# EAGLE design rpi2_brkout (EAGLE 7.7.0)
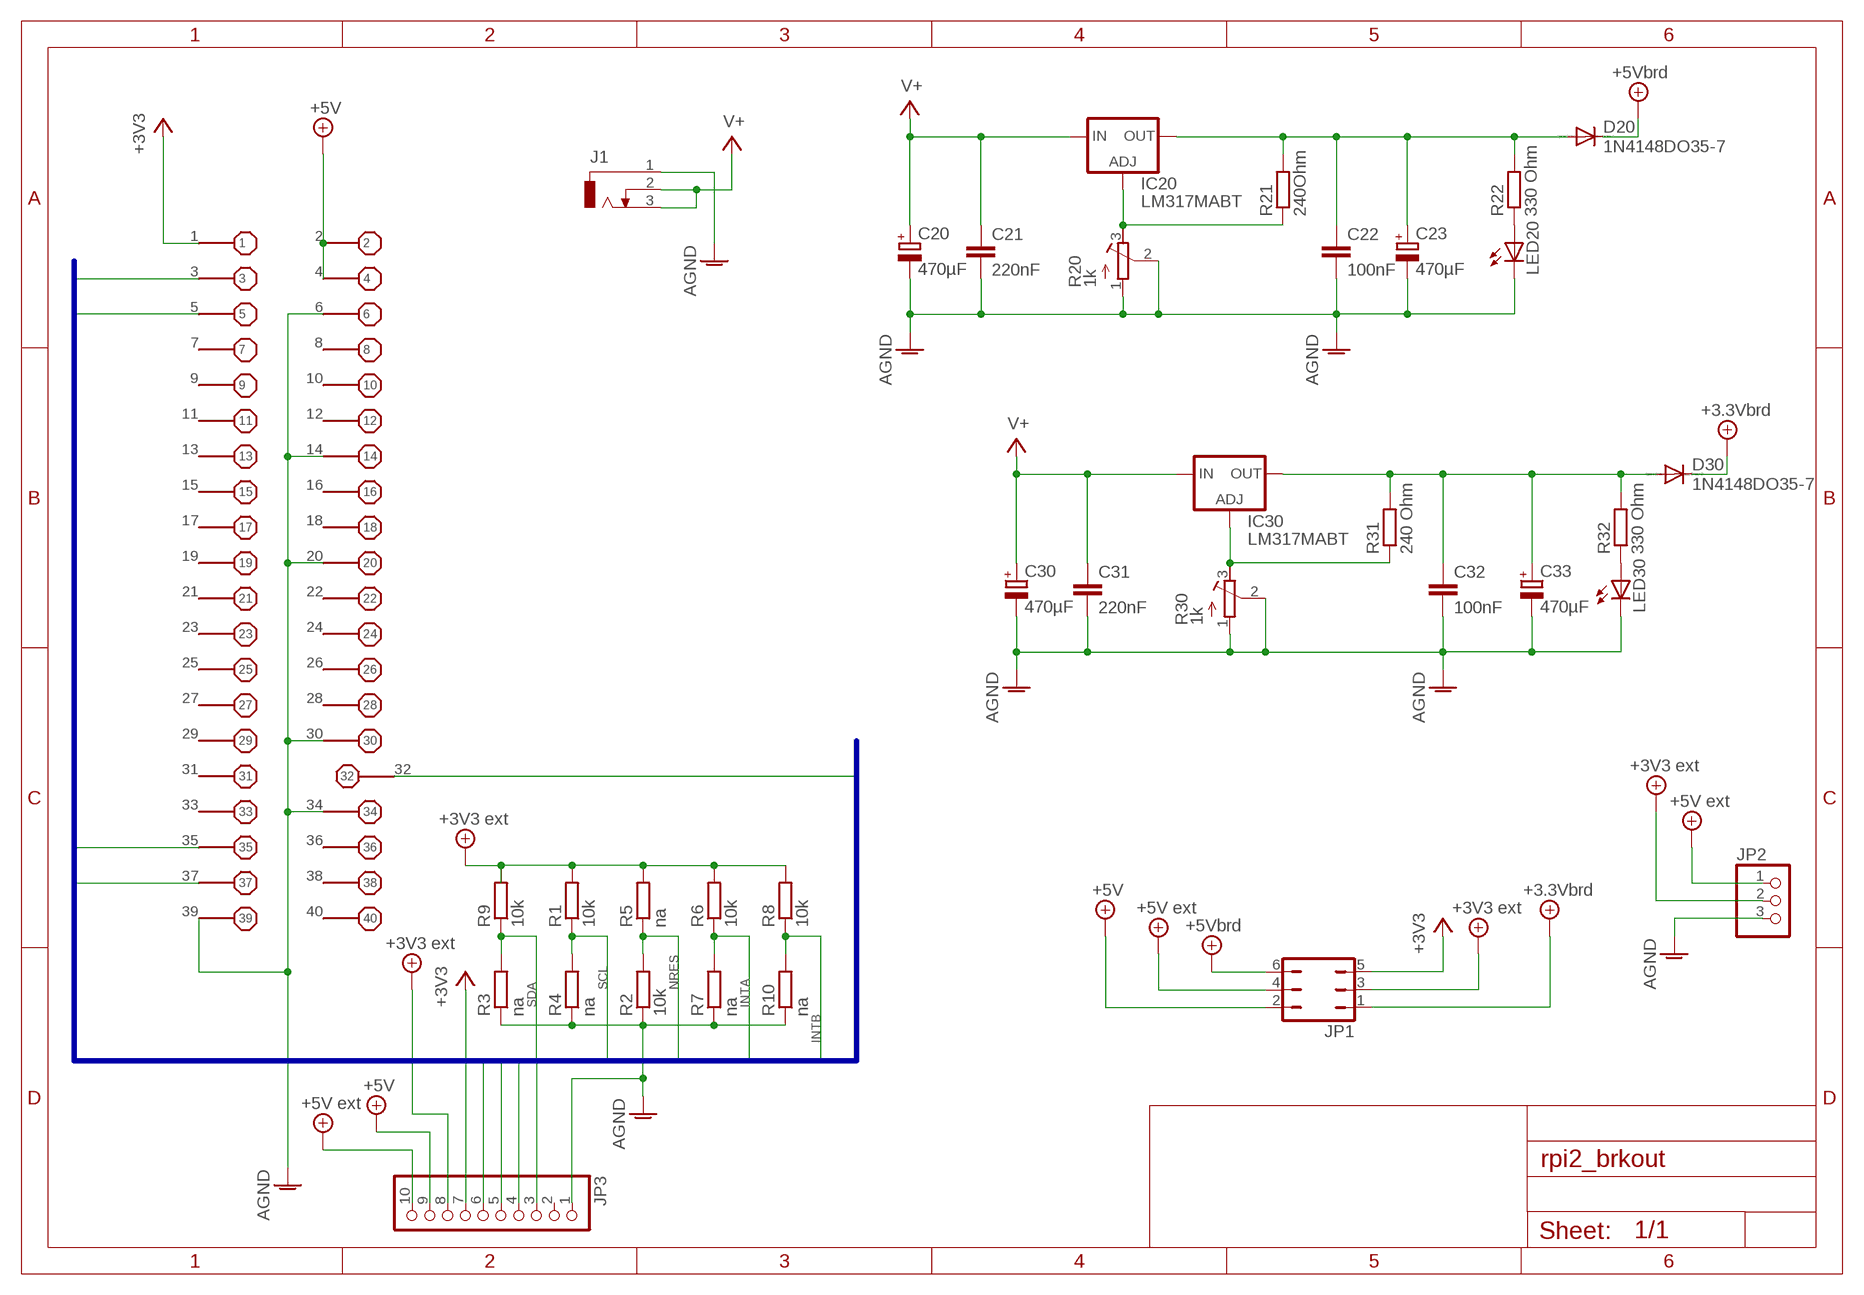
[diagram p0: schematic, sheet 1]

## Parts
C20  470µF  CPOL-EUE5-10.5  [E5-10,5]
C21  220nF  C-EU050-030X075  [C050-030X075]
C22  100nF  C-EU025-025X050  [C025-025X050]
C23  470µF  CPOL-EUE5-10.5  [E5-10,5]
C30  470µF  CPOL-EUE5-10.5  [E5-10,5]
C31  220nF  C-EU050-030X075  [C050-030X075]
C32  100nF  C-EU025-025X050  [C025-025X050]
C33  470µF  CPOL-EUE5-10.5  [E5-10,5]
D20  1N4148DO35-7  [DO35-7]
D30  1N4148DO35-7  [DO35-7]
IC20  LM317MABT  [TO220L1]
IC30  LM317MABT  [TO220L1]
J1  DCJ0303  [DCJ0303]
JP1  JP3Q  [JP3Q]
JP2  PINHD-1X3  [1X03]
JP3  PINHD-1X10  [1X10]
LED20  LED5MM  [LED5MM]
LED30  LED5MM  [LED5MM]
R1  10k  R-EU_R0805  [R0805]
R2  10k  R-EU_R0805  [R0805]
R3  na  R-EU_R0805  [R0805]
R4  na  R-EU_R0805  [R0805]
R5  na  R-EU_R0805  [R0805]
R6  10k  R-EU_R0805  [R0805]
R7  na  R-EU_R0805  [R0805]
R8  10k  R-EU_R0805  [R0805]
R9  10k  R-EU_R0805  [R0805]
R10  na  R-EU_R0805  [R0805]
R20  1k  R-TRIMM64W  [RTRIM64W]
R21  240Ohm  R-EU_0207/10  [0207/10]
R22  330 Ohm  R-EU_0207/10  [0207/10]
R30  1k  R-TRIMM64W  [RTRIM64W]
R31  240 Ohm  R-EU_0207/10  [0207/10]
R32  330 Ohm  R-EU_0207/10  [0207/10]
X1  B+_GPIO  [B+_GPIO]

## Nets
3.3VEXT: R1.2 R5.2 R6.2 R8.2 R9.2 ; supply symbol labelled +3V3 ext
+3V3: JP1.5 JP3.7 X1.1
+5V: JP1.2 JP3.9 X1.2 X1.4
+5V/1: JP1.4 JP2.1 JP3.10 ; supply symbol labelled +5V ext
+5V/2: JP1.3 JP2.2 JP3.8 ; supply symbol labelled +3V3 ext
+5V/3: D30.C JP1.1 ; supply symbol labelled +3.3Vbrd
+5V/4: D20.C JP1.6 ; supply symbol labelled +5Vbrd
AGND: C20.- C21.2 C22.2 C23.- C30.- C31.2 C32.2 C33.- J1.1 JP2.3 JP3.1 LED20.K(C) LED30.K(C) R2.1 R3.1 R4.1 R7.1 R10.1 R20.1(A) R20.2(S) R30.1(A) R30.2(S) X1.6 X1.14 X1.20 X1.30 X1.34 X1.39
INTA: JP3.5 R6.1 R7.2 X1.37
INTB: JP3.6 R8.1 R10.2 X1.35
N$1: IC30.1(ADJ) R30.3(E) R31.1
N$2: IC20.1(ADJ) R20.3(E) R21.1
N$3: C22.1 C23.+ D20.A IC20.2(OUT) R21.2 R22.2
N$4: LED20.A R22.1
N$5: C32.1 C33.+ D30.A IC30.2(OUT) R31.2 R32.2
N$6: LED30.A R32.1
NRES: R2.2 R5.1 X1.32
SCL: JP3.4 R1.1 R4.2 X1.5
SDA: JP3.3 R3.2 R9.1 X1.3
V+: C20.+ C21.1 C30.+ C31.1 IC20.3(IN) IC30.3(IN) J1.2 J1.3
Unconnected: JP3.2 X1.7 X1.8 X1.9 X1.10 X1.11 X1.12 X1.13 X1.15 X1.16 X1.17 X1.18 X1.19 X1.21 X1.22 X1.23 X1.24 X1.25 X1.26 X1.27 X1.28 X1.29 X1.31 X1.33 X1.36 X1.38 X1.40

## Buses
INTA,INTB,SCL,SDA,NRES

## Library data of the parts
C20 C23 C30 C33 = rcl:CPOL-EU: POLARIZED CAPACITOR, European symbol
C21 C22 C31 C32 = rcl:C-EU: CAPACITOR, European symbol
D20 D30 = diode:1N4148: DIODE high speed (Philips)
IC20 IC30 = v-reg:LM317?*: 500 mA Adjustable Output Positive Voltage Regulator Source: http://www.onsemi.co.jp .. LM317M-D.PDF
J1 = con-jack:DCJ0303: DC POWER JACK Source: DCJ0303.pdf; OC_FARNELL: unknown; OC_NEWARK: unknown
JP1 = jumper:JP3Q: JUMPER
JP2 = pinhead:PINHD-1X3: PIN HEADER
JP3 = pinhead:PINHD-1X10: PIN HEADER
LED20 LED30 = led:LED: LED OSRAM: - CHIPLED LG R971, LG N971, LY N971, LG Q971, LY Q971, LO R971, LY R971 LH N974, LH R974 LS Q976, LO Q976, LY Q976 LO Q996 - Hyper CHIPLED LW Q18S LB Q993, LB Q99A, LB R99A - SideLED LS A670, LO A670, LY A670, LG A670, LP A670 LB A673, LV A673, LT A673, LW A673 LH A674 LY A675 LS A676, LA A676, LO A676, LY A676, LW A676 LS A679, LY A679, LG A679 - Hyper Micro SIDELED® LS Y876, LA Y876, LO Y876, LY Y876 LT Y87S - SmartLED LW L88C, LW L88S LB L89C, LB L89S, LG L890 LS L89K, LO L89K, LY L89K LS L896, LA L896, LO L896, LY L896 - TOPLED LS T670, LO T670, LY T670, LG T670, LP T670 LSG T670, LSP T670, LSY T670, LOP T670, LYG T670 LG T671, LOG T671, LSG T671 LB T673, LV T673, LT T673, LW T673 LH T674 LS T676, LA T676, LO T676, LY T676, LB T676, LH T676, LSB T676, LW T676 LB T67C, LV T67C, LT T67C, LS T67K, LO T67K, LY T67K, LW E67C LS E67B, LA E67B, LO E67B, LY E67B, LB E67C, LV E67C, LT E67C LW T67C LS T679, LY T679, LG T679 LS T770, LO T770, LY T770, LG T770, LP T770 LB T773, LV T773, LT T773, LW T773 LH T774 LS E675, LA E675, LY E675, LS T675 LS T776, LA T776, LO T776, LY T776, LB T776 LHGB T686 LT T68C, LB T68C - Hyper Mini TOPLED® LB M676 - Mini TOPLED Santana® LG M470 LS M47K, LO M47K, LY M47K Source: http://www.osram.convergy.de LUXEON: - LUMILED® LXK2-PW12-R00, LXK2-PW12-S00, LXK2-PW14-U00, LXK2-PW14-V00 LXK2-PM12-R00, LXK2-PM12-S00, LXK2-PM14-U00 LXK2-PE12-Q00, LXK2-PE12-R00, LXK2-PE12-S00, LXK2-PE14-T00, LXK2-PE14-U00 LXK2-PB12-K00, LXK2-PB12-L00, LXK2-PB12-M00, LXK2-PB14-N00, LXK2-PB14-P00, LXK2-PB14-Q00 LXK2-PR12-L00, LXK2-PR12-M00, LXK2-PR14-Q00, LXK2-PR14-R00 LXK2-PD12-Q00, LXK2-PD12-R00, LXK2-PD12-S00 LXK2-PH12-R00, LXK2-PH12-S00 LXK2-PL12-P00, LXK2-PL12-Q00, LXK2-PL12-R00 Source: www.luxeon.com KINGBRIGHT: KA-3528ASYC Source: www.kingbright.com
R1-R10 R21 R22 R31 R32 = rcl:R-EU_: RESISTOR, European symbol
R20 R30 = rcl:R-TRIMM: Trimm resistor
X1 = raspberry:B+_GPIO

## Board
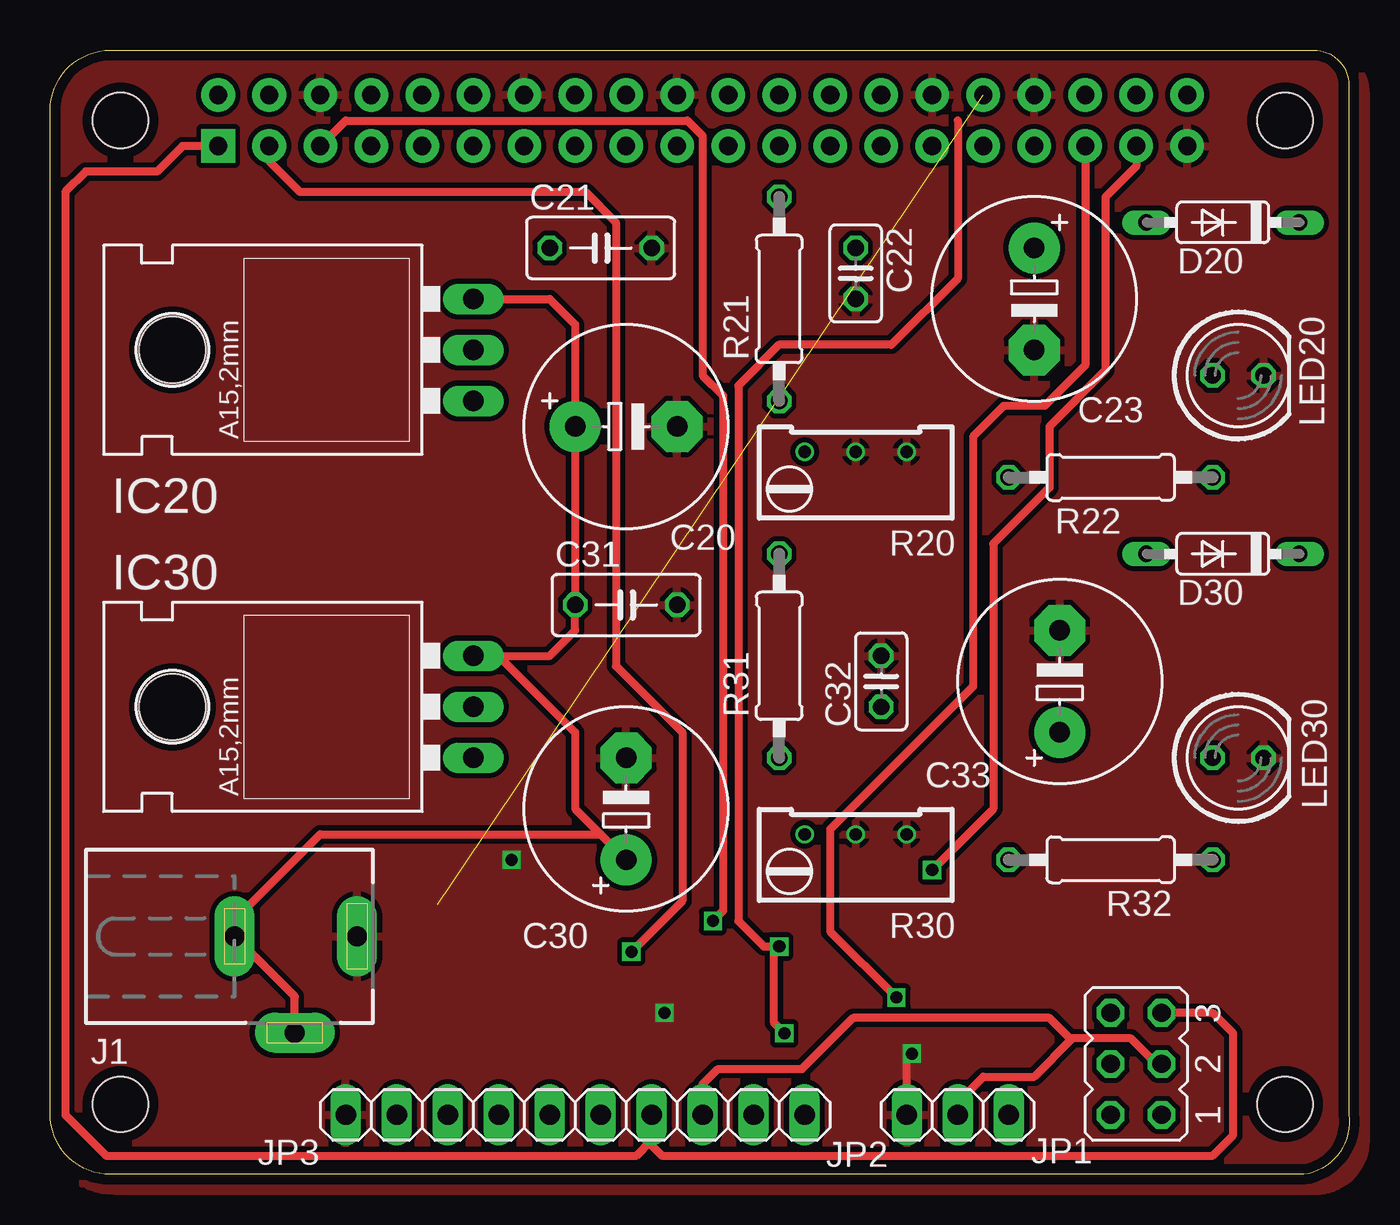
[diagram p1: board, top side]
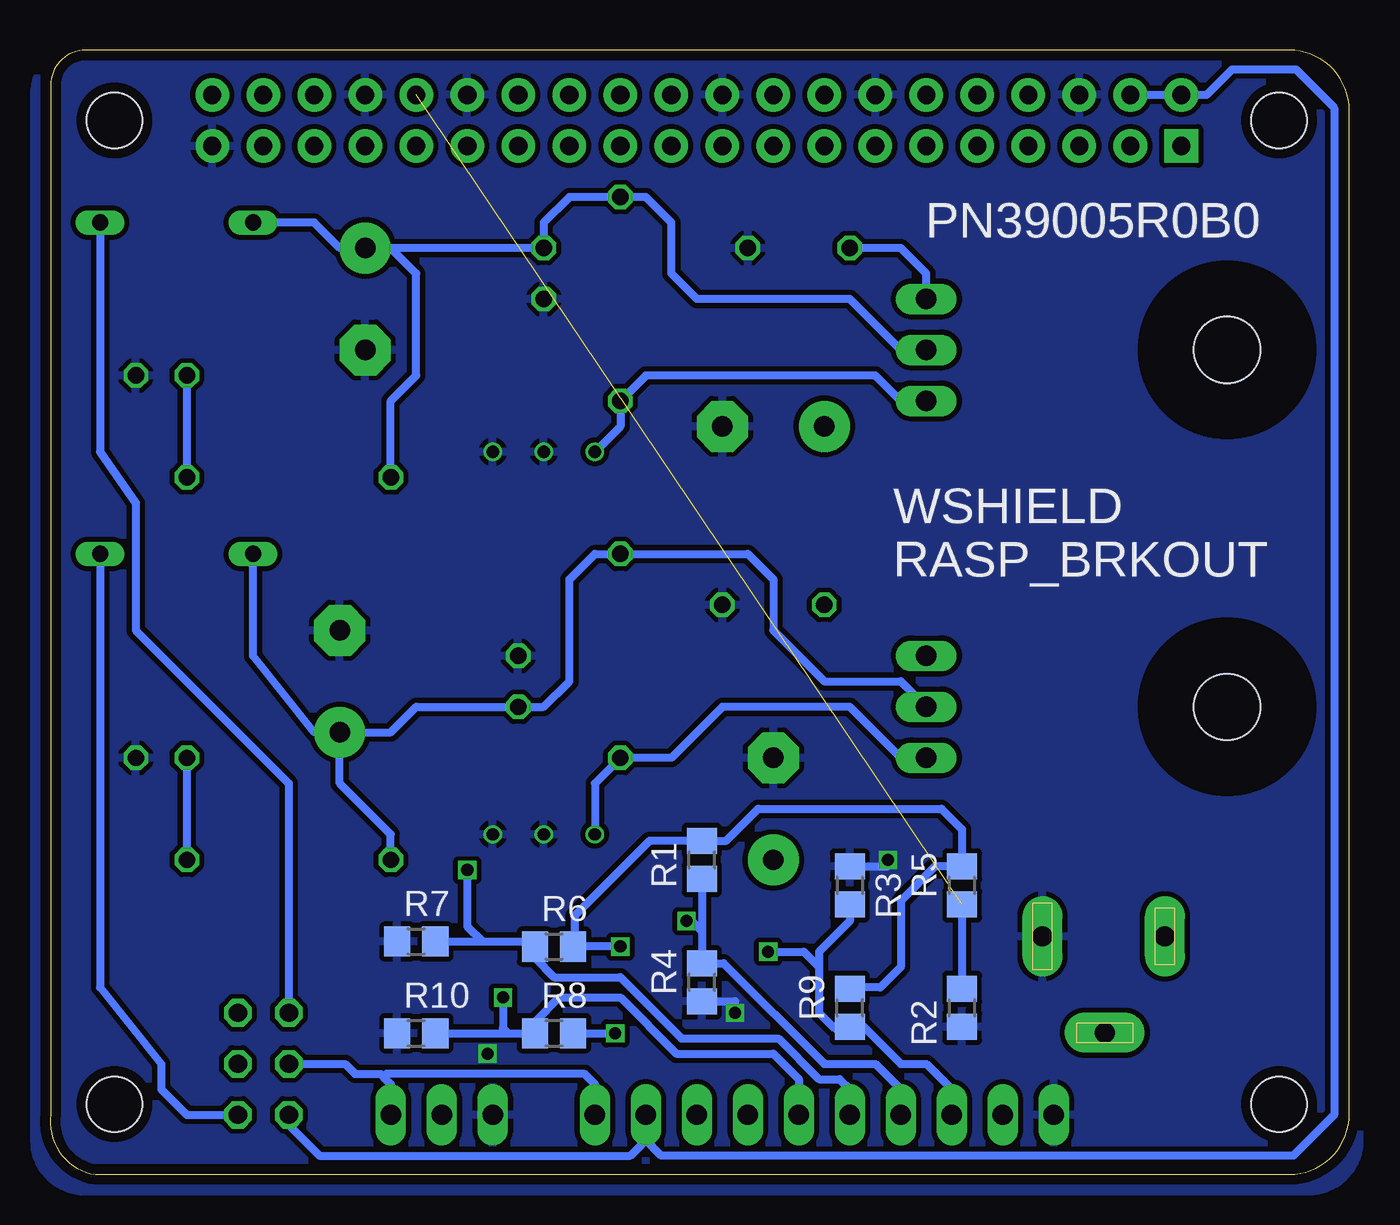
[diagram p2: board, bottom side, seen from below]

Size 64.71 x 56 mm. Coordinates in mm from the lower left corner, seen from the top.
Outline: 0,53 arc-90 3,56 62.95,56 arc-90 64.68,54.27 64.68,3 arc-90 62.44,0 3,0 arc-90 0,3 0,53
Copper layers (1*16): Top 0.035mm / dielectric 1.6mm / Bottom 0.035mm
Design rules "Elecrow_2-layer_PCB_eagle_rule": minimum track width 6mil, minimum drill 12mil, track to track 6mil, track to pad 6mil, pad to pad 6mil, via to via 8mil, smd to smd 0mil, copper to edge 20mil, drill to drill 10mil, minimum pad ring 6mil, minimum via ring 6mil, stop-mask expansion 0mil, vias tented up to drill 100mil, thermal gap 10mil
Holes 2.75 mm at 3.5,52.5 3.5,3.5 61.5,52.5 61.5,3.5

### Footprints (pad centres in the part's own frame; a part is rotated, then mirrored left to right if it is on the bottom)
E5-10,5 = drill 1.016 pad 2.54: + -2.54,0 | drill 1.016 pad 2.54 octagon: - 2.54,0
C050-030X075 = drill 0.813 octagon: 1 -2.54,0; 2 2.54,0
C025-025X050 = drill 0.813 octagon: 1 -1.27,0; 2 1.27,0
DO35-7 = drill 0.813 long: A 3.81,0; C -3.81,0
TO220L1 = drill 1.016 long: 1 -2.54,-3.81; 2 0,-3.81; 3 2.54,-3.81 | hole 3.302: 0,11.176
DCJ0303 = drill 1 pad 2 long: 1 0,3.1; 2 4.8,0; 3 0,-3
JP3Q = drill 0.914 octagon: 1 -2.54,-1.27; 2 -2.54,1.27; 3 0,-1.27; 4 0,1.27; 5 2.54,-1.27; 6 2.54,1.27
1X03 = drill 1.016 long: 1 -2.54,0; 2 0,0; 3 2.54,0
1X10 = drill 1.016 long: 1 -11.43,0; 2 -8.89,0; 3 -6.35,0; 4 -3.81,0; 5 -1.27,0; 6 1.27,0; 7 3.81,0; 8 6.35,0; 9 8.89,0; 10 11.43,0
LED5MM = drill 0.813 octagon: A -1.27,0; K 1.27,0
R0805 = smd 1.3 x 1.5: 1 -0.95,0; 2 0.95,0
RTRIM64W = drill 0.61: 1 1.27,-2.54; 2 1.27,0; 3 1.27,2.54
0207/10 = drill 0.813 octagon: 1 -5.08,0; 2 5.08,0
B+_GPIO = drill 0.9 pad 1.676 square: 1 -24.13,-1.27 | drill 0.9 pad 1.676: 2 -24.13,1.27; 3 -21.59,-1.27; 4 -21.59,1.27; 5 -19.05,-1.27; 6 -19.05,1.27; 7 -16.51,-1.27; 8 -16.51,1.27; 9 -13.97,-1.27; 10 -13.97,1.27; 11 -11.43,-1.27; 12 -11.43,1.27; 13 -8.89,-1.27; 14 -8.89,1.27; 15 -6.35,-1.27; 16 -6.35,1.27; 17 -3.81,-1.27; 18 -3.81,1.27; 19 -1.27,-1.27; 20 -1.27,1.27; 21 1.27,-1.27; 22 1.27,1.27; 23 3.81,-1.27; 24 3.81,1.27; 25 6.35,-1.27; 26 6.35,1.27; 27 8.89,-1.27; 28 8.89,1.27; 29 11.43,-1.27; 30 11.43,1.27; 31 13.97,-1.27; 32 13.97,1.27; 33 16.51,-1.27; 34 16.51,1.27; 35 19.05,-1.27; 36 19.05,1.27; 37 21.59,-1.27; 38 21.59,1.27; 39 24.13,-1.27; 40 24.13,1.27

### Placement (x,y rotation side)
C20  28.69,37.26 0 top
C21  27.42,46.15 0 top
C22  40.12,44.88 270 top
C23  49.01,43.61 270 top
C30  28.69,18.21 90 top
C31  28.69,28.37 0 top
C32  41.39,24.56 90 top
C33  50.28,24.56 90 top
D20  58.41,47.42 180 top
D30  58.41,30.91 180 top
IC20  17.26,41.07 90 top
IC30  17.26,23.29 90 top
J1  12.18,11.86 270 top
JP1  54.09,5.51 90 top
JP2  45.2,2.97 180 top
JP3  26.15,2.97 0 top
LED20  59.17,39.8 0 top
LED30  59.17,20.75 0 top
R1  32.25,15.67 90 bottom
R2  19.29,8.3 90 bottom
R3  24.88,14.4 270 bottom
R4  32.25,9.57 90 bottom
R5  19.29,14.4 90 bottom
R6  39.61,11.35 0 bottom
R7  46.47,11.61 0 bottom
R8  39.61,7.03 0 bottom
R9  24.88,8.3 90 bottom
R10  46.47,7.03 0 bottom
R20  40.12,34.72 90 top
R21  36.31,43.61 90 top
R22  52.82,34.72 180 top
R30  40.12,15.67 90 top
R31  36.31,25.83 90 top
R32  52.82,15.67 180 top
X1  32.5,52.5 0 top

### Tracks (layer width: path | path; a pad name or v marks a point on that pad's centre or on a via)
3.3VEXT  (via drill 0.6)
  Top 0.406: v36.56,7.03 36.06,7.54 36.06,11.1 v36.31,11.35 35.55,11.35 34.28,12.62 34.28,39.29 36.31,41.32 41.9,41.32 45.2,44.63 45.2,52.5
  Bottom 0.406: R9.2 24.81,9.32 23.36,9.32 22.34,10.34 22.34,13.64 20.63,15.35 R5.2 19.29,17.19 20.31,18.21 29.45,18.21 31.04,16.62 R1.2 34.85,16.62 38.6,12.88 38.6,11.42 R6.2 v36.31,11.35 | R8.2 v36.56,7.03
+3V3
  Top 0.406: X1.1 6.59,51.23 5.32,49.96 1.77,49.96 0.75,48.94 0.75,2.97 2.78,0.94 29.2,0.94 29.96,1.7 JP3.7 29.96,1.45 30.47,0.94 57.9,0.94 58.92,1.95 58.92,7.03 57.9,8.05 JP1.5
+5V
  Bottom 0.406: 35.04,1.7 34.28,0.94 2.78,0.94 0.75,2.97 0.75,53.13 2.66,55.04 5.83,55.04 7.1,53.77 X1.2 X1.4 | 35.04,1.7 JP3.9 | JP1.2 52.82,2.46 51.3,0.94 35.8,0.94 35.04,1.7
+5V/1
  Bottom 0.406: JP1.4 50.03,5.51 49.52,5 48.25,5 48.12,4.88 | 48.12,4.88 47.74,4.49 JP2.1 | JP3.10 37.58,4.49 38.09,5 47.99,5 48.12,4.88
+5V/2
  Top 0.406: JP1.3 55.11,5.51 53.84,6.78 50.91,6.78 | JP3.8 32.5,4.49 33.26,5.26 37.45,5.26 39.99,7.8 49.77,7.8 50.79,6.78 50.91,6.78 | JP2.2 45.2,3.6 46.47,4.88 49.01,4.88 50.91,6.78
+5V/3
  Bottom 0.406: D30.C 62.22,9.32 59.17,5.51 59.17,4.24 57.9,2.97 JP1.1
+5V/4
  Bottom 0.406: D20.C 62.22,35.99 60.44,33.45 60.44,27.1 52.82,19.48 JP1.6
AGND  (via drill 0.6)
  Top 0.406: JP2.3 42.66,5.76 v42.91,6.02
  Bottom 0.406: R4.1 30.59,8.62 v30.59,8.05 | R3.1 22.98,15.35 v22.98,15.67
  pour Bottom (isolate 0.254): -0.52,52.5 arc-90 3.29,56.31 4.56,56.31 62.98,56.31 arc-90 65.52,53.77 65.52,1.7 arc-90 62.98,-0.84 61.71,-0.84 2.02,-0.84 arc-90 -0.52,1.7 -0.52,2.97
  pour Top (isolate 0.254): -0.52,52.5 arc-90 3.29,56.31 4.56,56.31 62.98,56.31 arc-90 65.52,53.77 65.52,52.5 65.52,1.7 arc-90 62.98,-0.84 61.71,-0.84 3.29,-0.84 arc-90 -0.52,2.97
INTA  (via drill 0.6)
  Top 0.406: X1.37 54.09,50.21 52.57,48.69 52.57,40.05 49.77,37.26 49.77,34.21 46.98,31.42 46.98,18.21 v43.93,15.16
  Bottom 0.406: JP3.5 24.88,4.24 25.39,4.75 26.4,4.75 28.44,6.78 33.26,6.78 36.31,9.83 39.61,9.83 40.56,10.78 R6.1 40.82,11.61 43.17,11.61 | R7.2 43.17,11.61 | v43.93,15.16 43.93,12.37 43.17,11.61
INTB  (via drill 0.6)
  Top 0.406: X1.35 51.55,40.31 49.52,38.28 47.49,38.28 45.96,36.75 45.96,24.31 38.85,17.19 38.85,12.11 v42.15,8.81
  Bottom 0.406: JP3.6 27.42,4.75 28.69,6.02 33.52,6.02 36.31,8.81 39.36,8.81 40.56,7.61 R8.1 41.9,7.03 | R10.2 41.9,7.03 | v42.15,8.81 42.15,7.29 41.9,7.03
N$1
  Bottom 0.406: IC30.1 22.34,20.75 24.88,23.29 31.23,23.29 33.77,20.75 R31.1 37.58,19.48 R30.3
N$2
  Bottom 0.406: IC20.1 22.34,38.53 23.61,39.8 35.04,39.8 R21.1 36.31,37.26 R20.3
N$3
  Bottom 0.406: 47.74,46.15 C22.1 40.12,47.42 38.85,48.69 R21.2 35.04,48.69 33.77,47.42 33.77,44.88 32.5,43.61 24.88,43.61 22.34,41.07 IC20.2 | 47.74,46.15 C23.+ 50.28,46.15 51.55,47.42 D20.A | R22.2 47.74,38.53 46.47,39.8 46.47,44.88 47.74,46.15
N$4
  Bottom 0.406: LED20.A R22.1
N$5
  Bottom 0.406: C33.+ 47.74,22.02 46.47,23.29 C32.1 40.12,23.29 38.85,24.56 38.85,29.64 37.58,30.91 R31.2 29.96,30.91 28.69,29.64 28.69,27.1 26.15,24.56 22.34,24.56 IC30.2 | R32.2 47.74,16.94 50.28,19.48 C33.+ | C33.+ 51.55,22.02 54.6,25.83 D30.A
N$6
  Bottom 0.406: LED30.A R32.1
NRES  (1 unrouted)
  Bottom 0.406: R5.1 R2.2
SCL  (via drill 0.6)
  Top 0.406: X1.5 14.72,52.5 31.74,52.5 32.5,51.74 32.5,39.8 33.52,38.78 33.52,13.13 v33.01,12.62
  Bottom 0.406: JP3.4 22.34,4.24 23.61,5.51 26.15,5.51 31.16,10.52 R4.2 32.25,12.11 | R1.1 32.25,12.11 | v33.01,12.62 32.75,12.62 32.25,12.11
SDA  (via drill 0.6)
  Top 0.406: X1.3 10.91,50.47 12.43,48.94 26.66,48.94 28.18,47.42 28.18,25.32 31.48,22.02 31.48,13.64 v28.94,11.1
  Bottom 0.406: JP3.3 19.8,4.24 21.07,5.51 22.34,5.51 24.18,7.35 R9.1 24.95,7.29 25.64,7.29 26.4,8.05 26.4,10.34 | R3.2 24.88,12.62 26.4,11.1 26.4,10.34 | v28.94,11.1 27.17,11.1 26.4,10.34
V+
  Top 0.406: IC20.3 24.88,43.61 26.15,42.34 C20.+ C31.1 26.15,27.1 24.88,25.83 IC30.3 22.34,25.83 26.15,22.02 26.15,18.21 C30.+ 27.42,16.94 13.45,16.94 9.18,12.67 J1.3 12.18,8.86 J1.2
  Bottom 0.406: IC20.3 21.07,44.88 22.34,46.15 C21.1

### Text on the board
bNames: PN39005R0B0 | WSHIELD / RASP_BRKOUT